# EAGLE schematic untitled (EAGLE 9.6.2)

## Sheet 1 of 2
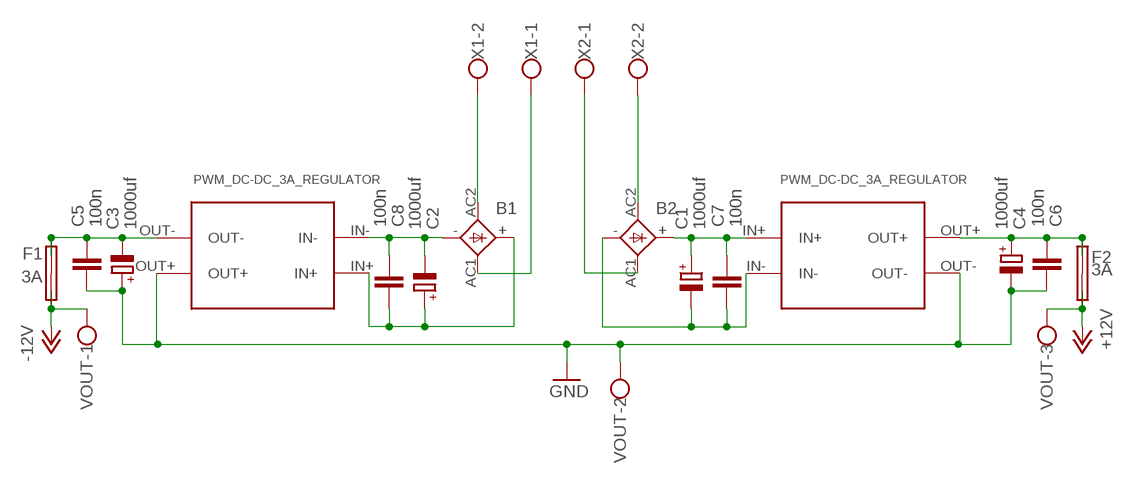
[diagram p0: schematic, sheet 1]

### Parts
B1  FB15  [FB15]
B2  FB15  [FB15]
C1  1000uf  CPOL-EUTT5D11  [TT5D11]
C2  1000uf  CPOL-EUTT5D11  [TT5D11]
C3  1000uf  CPOL-EUTT5D11  [TT5D11]
C4  1000uf  CPOL-EUTT5D11  [TT5D11]
C5  100n  C-EU075-032X103  [C075-032X103]
C6  100n  C-EU075-032X103  [C075-032X103]
C7  100n  C-EU075-032X103  [C075-032X103]
C8  100n  C-EU075-032X103  [C075-032X103]
F1  3A  SHK20L  [SHK20L]
F2  3A  SHK20L  [SHK20L]
PWM_DC-DC_3A_REGULATOR1  CP8-ADJ  [CP8-ADJ]
PWM_DC-DC_3A_REGULATOR2  CP8-ADJ  [CP8-ADJ]
VOUT  W237-103  [W237-103]
X1  W237-102  [W237-102]
X2  W237-102  [W237-102]

### Nets
+12V: F2.1A F2.1B VOUT.3 ; also sheet 2
-12V: F1.1A F1.1B VOUT.1 ; also sheet 2
GND: C3.+ C4.- C5.2 C6.1 PWM_DC-DC_3A_REGULATOR1.OUT+ PWM_DC-DC_3A_REGULATOR2.OUT- VOUT.2 ; also sheet 2
N$1: B2.+ C1.+ C7.2 PWM_DC-DC_3A_REGULATOR2.IN+
N$2: B1.- C2.- C8.2 PWM_DC-DC_3A_REGULATOR1.IN-
N$4: B2.- C1.- C7.1 PWM_DC-DC_3A_REGULATOR2.IN-
N$5: C4.+ C6.2 F2.2A F2.2B PWM_DC-DC_3A_REGULATOR2.OUT+
N$6: C3.- C5.1 F1.2A F1.2B PWM_DC-DC_3A_REGULATOR1.OUT-
N$7: B1.AC2 X1.2
N$8: B2.AC2 X2.2
N$9: B1.AC1 X1.1
N$10: B2.AC1 X2.1
N$11: B1.+ C2.+ C8.1 PWM_DC-DC_3A_REGULATOR1.IN+

### Notes on the sheet
- PWM_DC-DC_3A_REGULATOR | PWM_DC-DC_3A_REGULATOR

## Sheet 2 of 2
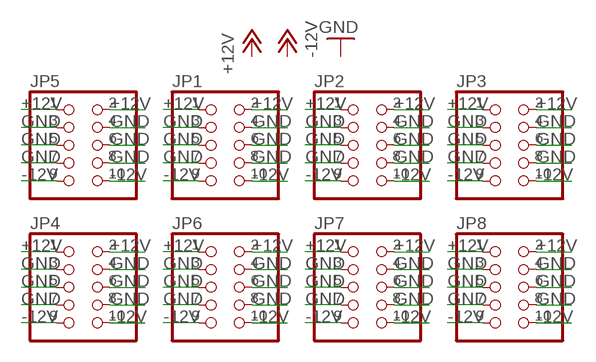
[diagram p1: schematic, sheet 2]

### Parts
JP1  PINHD-2X5  [2X05]
JP2  PINHD-2X5  [2X05]
JP3  PINHD-2X5  [2X05]
JP4  PINHD-2X5  [2X05]
JP5  PINHD-2X5  [2X05]
JP6  PINHD-2X5  [2X05]
JP7  PINHD-2X5  [2X05]
JP8  PINHD-2X5  [2X05]

### Nets
+12V: JP1.1 JP1.2 JP2.1 JP2.2 JP3.1 JP3.2 JP4.1 JP4.2 JP5.1 JP5.2 JP6.1 JP6.2 JP7.1 JP7.2 JP8.1 JP8.2 ; also sheet 1
-12V: JP1.9 JP1.10 JP2.9 JP2.10 JP3.9 JP3.10 JP4.9 JP4.10 JP5.9 JP5.10 JP6.9 JP6.10 JP7.9 JP7.10 JP8.9 JP8.10 ; also sheet 1
GND: JP1.3 JP1.4 JP1.5 JP1.6 JP1.7 JP1.8 JP2.3 JP2.4 JP2.5 JP2.6 JP2.7 JP2.8 JP3.3 JP3.4 JP3.5 JP3.6 JP3.7 JP3.8 JP4.3 JP4.4 JP4.5 JP4.6 JP4.7 JP4.8 JP5.3 JP5.4 JP5.5 JP5.6 JP5.7 JP5.8 JP6.3 JP6.4 JP6.5 JP6.6 JP6.7 JP6.8 JP7.3 JP7.4 JP7.5 JP7.6 JP7.7 JP7.8 JP8.3 JP8.4 JP8.5 JP8.6 JP8.7 JP8.8 ; also sheet 1

## Library data of the parts
B1 B2 = rectifier:FB15: FAGOR RECTIFIER grid 3 x 5 mm
C1-C4 = resistor:CPOL-EU: POLARIZED CAPACITOR, European symbol
C5-C8 = resistor:C-EU: CAPACITOR, European symbol
F1 F2 = fuse:SHK20L: FUSE HOLDER 5 x 20 mm, SH contact, SHH1 Schukat, E1073 Buerklin; OC_FARNELL: unknown; OC_NEWARK: unknown
JP1-JP8 = pinhead:PINHD-2X5: PIN HEADER
PWM_DC-DC_3A_REGULATOR1 PWM_DC-DC_3A_REGULATOR2 = regulators:CP8-ADJ: Voltage regulator IN: 7-35V OUT: ADJ
VOUT = con-wago-500:W237-103: WAGO SCREW CLAMP; MPN: 237-103; OC_FARNELL: unknown; OC_NEWARK: 18M7116
X1 X2 = con-wago-500:W237-102: WAGO SCREW CLAMP; MPN: 237-102; OC_FARNELL: unknown; OC_NEWARK: 70K9898